# Altium project VESC_DEVICE_75100.PrjPcb
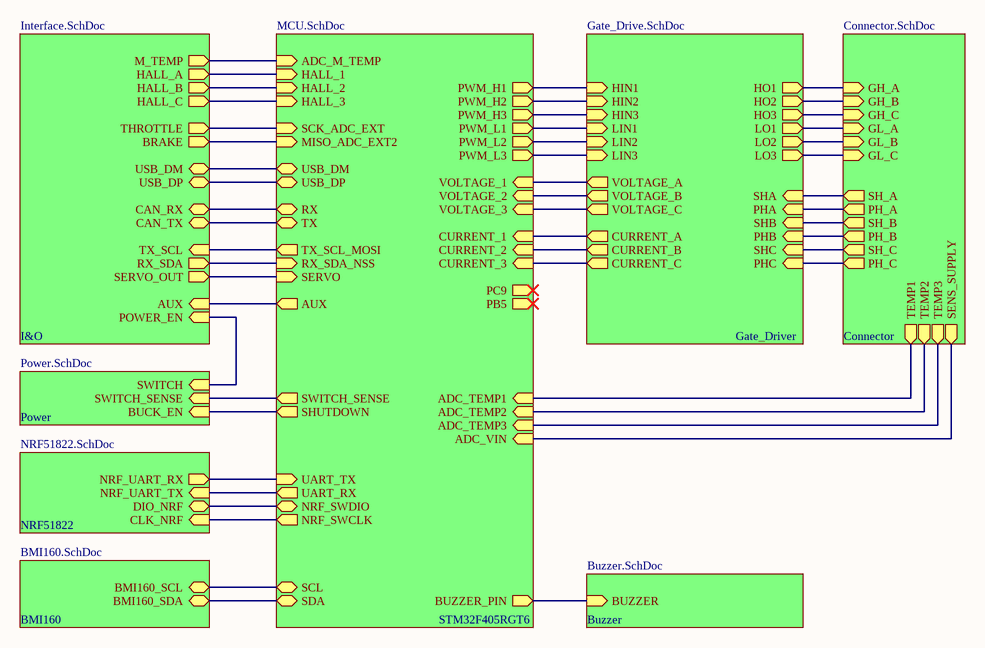
[diagram p0: VESC_75100.SchDoc]
9 sheets, 217 parts. Net scope: hierarchical (ports join the sheet entries above them; power ports are global).
Board file: VESC_DEVICE_75100.PcbDoc
Sheets:
  VESC_75100.SchDoc
    STM32F405RGT6 = MCU.SchDoc
    Gate_Driver = Gate_Drive.SchDoc
    I&O = Interface.SchDoc
    Power = Power.SchDoc
    NRF51822 = NRF51822.SchDoc
    BMI160 = BMI160.SchDoc
    Connector = Connector.SchDoc
    Buzzer = Buzzer.SchDoc

## Sheet VESC_75100.SchDoc
size A4

### Sub-sheets
BMI160 = BMI160.SchDoc: BMI160_SCL (bidir), BMI160_SDA (bidir)
Buzzer = Buzzer.SchDoc: BUZZER (in)
Connector = Connector.SchDoc: TEMP1 (out), TEMP2 (out), TEMP3 (out), SH_A (out), SH_B (out), SH_C (out), PH_B (out), PH_C (out), PH_A (out), GL_A (in), GL_B (in), GL_C (in), GH_A (in), GH_B (in), GH_C (in), SENS_SUPPLY (out)
Gate_Driver = Gate_Drive.SchDoc: HIN3 (in), LIN3 (in), LIN1 (in), LIN2 (in), HIN1 (in), HIN2 (in), HO1 (out), HO2 (out), HO3 (out), LO1 (out), LO2 (out), LO3 (out), CURRENT_A (out), CURRENT_B (out), CURRENT_C (out), VOLTAGE_C (out), VOLTAGE_B (out), VOLTAGE_A (out), SHA (in), PHA (in), SHB (in), PHB (in), SHC (in), PHC (in)
I&O = Interface.SchDoc: CAN_TX (bidir), CAN_RX (bidir), USB_DP (bidir), USB_DM (bidir), SERVO_OUT (out), RX_SDA (out), TX_SCL (in), HALL_A (out), HALL_B (out), HALL_C (out), M_TEMP (out), POWER_EN (in), BRAKE (out), THROTTLE (out), AUX (in)
NRF51822 = NRF51822.SchDoc: NRF_UART_RX (out), NRF_UART_TX (in), DIO_NRF (bidir), CLK_NRF (in)
Power = Power.SchDoc: BUCK_EN (in), SWITCH (in), SWITCH_SENSE (in)
STM32F405RGT6 = MCU.SchDoc: ADC_TEMP1 (in), RX_SDA_NSS (in), SCK_ADC_EXT (in), MISO_ADC_EXT2 (in), TX_SCL_MOSI (out), USB_DM (bidir), USB_DP (bidir), ADC_TEMP2 (in), ADC_TEMP3 (in), SERVO (in), RX (bidir), TX (bidir), ADC_VIN (in), ADC_M_TEMP (in), SHUTDOWN (out), HALL_1 (in), HALL_2 (in), HALL_3 (in), PC9 (out), UART_TX (in), UART_RX (out), SDA (bidir), SCL (bidir), PWM_L1 (out), PWM_H1 (out), PWM_L2 (out), PWM_L3 (out), PWM_H2 (out), PWM_H3 (out), VOLTAGE_1 (in), VOLTAGE_2 (in), VOLTAGE_3 (in), CURRENT_1 (in), CURRENT_2 (in), CURRENT_3 (in), NRF_SWDIO (bidir), NRF_SWCLK (out), SWITCH_SENSE (out), BUZZER_PIN (out), AUX (out), PB5 (out)

### Nets
ADC_TEMP1: sheet STM32F405RGT6/ADC_TEMP1, sheet Connector/TEMP1
ADC_TEMP2: sheet STM32F405RGT6/ADC_TEMP2, sheet Connector/TEMP2
ADC_TEMP3: sheet STM32F405RGT6/ADC_TEMP3, sheet Connector/TEMP3
ADC_VIN: sheet STM32F405RGT6/ADC_VIN, sheet Connector/SENS_SUPPLY
AUX: sheet STM32F405RGT6/AUX, sheet I&O/AUX
BMI160_SCL: sheet STM32F405RGT6/SCL, sheet BMI160/BMI160_SCL
BMI160_SDA: sheet STM32F405RGT6/SDA, sheet BMI160/BMI160_SDA
BRAKE: sheet STM32F405RGT6/MISO_ADC_EXT2, sheet I&O/BRAKE
BUCK_EN: sheet STM32F405RGT6/SHUTDOWN, sheet Power/BUCK_EN
BUZZER: sheet STM32F405RGT6/BUZZER_PIN, sheet Buzzer/BUZZER
CAN_RX: sheet STM32F405RGT6/RX, sheet I&O/CAN_RX
CAN_TX: sheet STM32F405RGT6/TX, sheet I&O/CAN_TX
CLK_NRF: sheet STM32F405RGT6/NRF_SWCLK, sheet NRF51822/CLK_NRF
CURRENT_1: sheet STM32F405RGT6/CURRENT_1, sheet Gate_Driver/CURRENT_A
CURRENT_2: sheet STM32F405RGT6/CURRENT_2, sheet Gate_Driver/CURRENT_B
CURRENT_3: sheet STM32F405RGT6/CURRENT_3, sheet Gate_Driver/CURRENT_C
DIO_NRF: sheet STM32F405RGT6/NRF_SWDIO, sheet NRF51822/DIO_NRF
GH_A: sheet Gate_Driver/HO1, sheet Connector/GH_A
GH_B: sheet Gate_Driver/HO2, sheet Connector/GH_B
GH_C: sheet Gate_Driver/HO3, sheet Connector/GH_C
GL_A: sheet Gate_Driver/LO1, sheet Connector/GL_A
GL_B: sheet Gate_Driver/LO2, sheet Connector/GL_B
GL_C: sheet Gate_Driver/LO3, sheet Connector/GL_C
HALL_1: sheet STM32F405RGT6/HALL_1, sheet I&O/HALL_A
HALL_2: sheet STM32F405RGT6/HALL_2, sheet I&O/HALL_B
HALL_3: sheet STM32F405RGT6/HALL_3, sheet I&O/HALL_C
HIN1: sheet STM32F405RGT6/PWM_H1, sheet Gate_Driver/HIN1
HIN2: sheet STM32F405RGT6/PWM_H2, sheet Gate_Driver/HIN2
HIN3: sheet STM32F405RGT6/PWM_H3, sheet Gate_Driver/HIN3
LIN1: sheet STM32F405RGT6/PWM_L1, sheet Gate_Driver/LIN1
LIN2: sheet STM32F405RGT6/PWM_L2, sheet Gate_Driver/LIN2
LIN3: sheet STM32F405RGT6/PWM_L3, sheet Gate_Driver/LIN3
M_TEMP: sheet STM32F405RGT6/ADC_M_TEMP, sheet I&O/M_TEMP
NRF_UART_RX: sheet STM32F405RGT6/UART_TX, sheet NRF51822/NRF_UART_RX
NRF_UART_TX: sheet STM32F405RGT6/UART_RX, sheet NRF51822/NRF_UART_TX
PHA: sheet Gate_Driver/PHA, sheet Connector/PH_A
PHB: sheet Gate_Driver/PHB, sheet Connector/PH_B
PHC: sheet Gate_Driver/PHC, sheet Connector/PH_C
POWER_EN: sheet I&O/POWER_EN, sheet Power/SWITCH
RX_SDA_NSS: sheet STM32F405RGT6/RX_SDA_NSS, sheet I&O/RX_SDA
SCK_ADC_EXT: sheet STM32F405RGT6/SCK_ADC_EXT, sheet I&O/THROTTLE
SERVO: sheet STM32F405RGT6/SERVO, sheet I&O/SERVO_OUT
SHA: sheet Gate_Driver/SHA, sheet Connector/SH_A
SHB: sheet Gate_Driver/SHB, sheet Connector/SH_B
SHC: sheet Gate_Driver/SHC, sheet Connector/SH_C
SWITCH_SENSE: sheet STM32F405RGT6/SWITCH_SENSE, sheet Power/SWITCH_SENSE
TX_SCL_MOSI: sheet STM32F405RGT6/TX_SCL_MOSI, sheet I&O/TX_SCL
USB_DM: sheet STM32F405RGT6/USB_DM, sheet I&O/USB_DM
USB_DP: sheet STM32F405RGT6/USB_DP, sheet I&O/USB_DP
VOLTAGE_A: sheet STM32F405RGT6/VOLTAGE_1, sheet Gate_Driver/VOLTAGE_A
VOLTAGE_B: sheet STM32F405RGT6/VOLTAGE_2, sheet Gate_Driver/VOLTAGE_B
VOLTAGE_C: sheet STM32F405RGT6/VOLTAGE_3, sheet Gate_Driver/VOLTAGE_C

## Sheet MCU.SchDoc: STM32F405RGT6
size A4; SheetNumber: 1; SheetTotal: 7
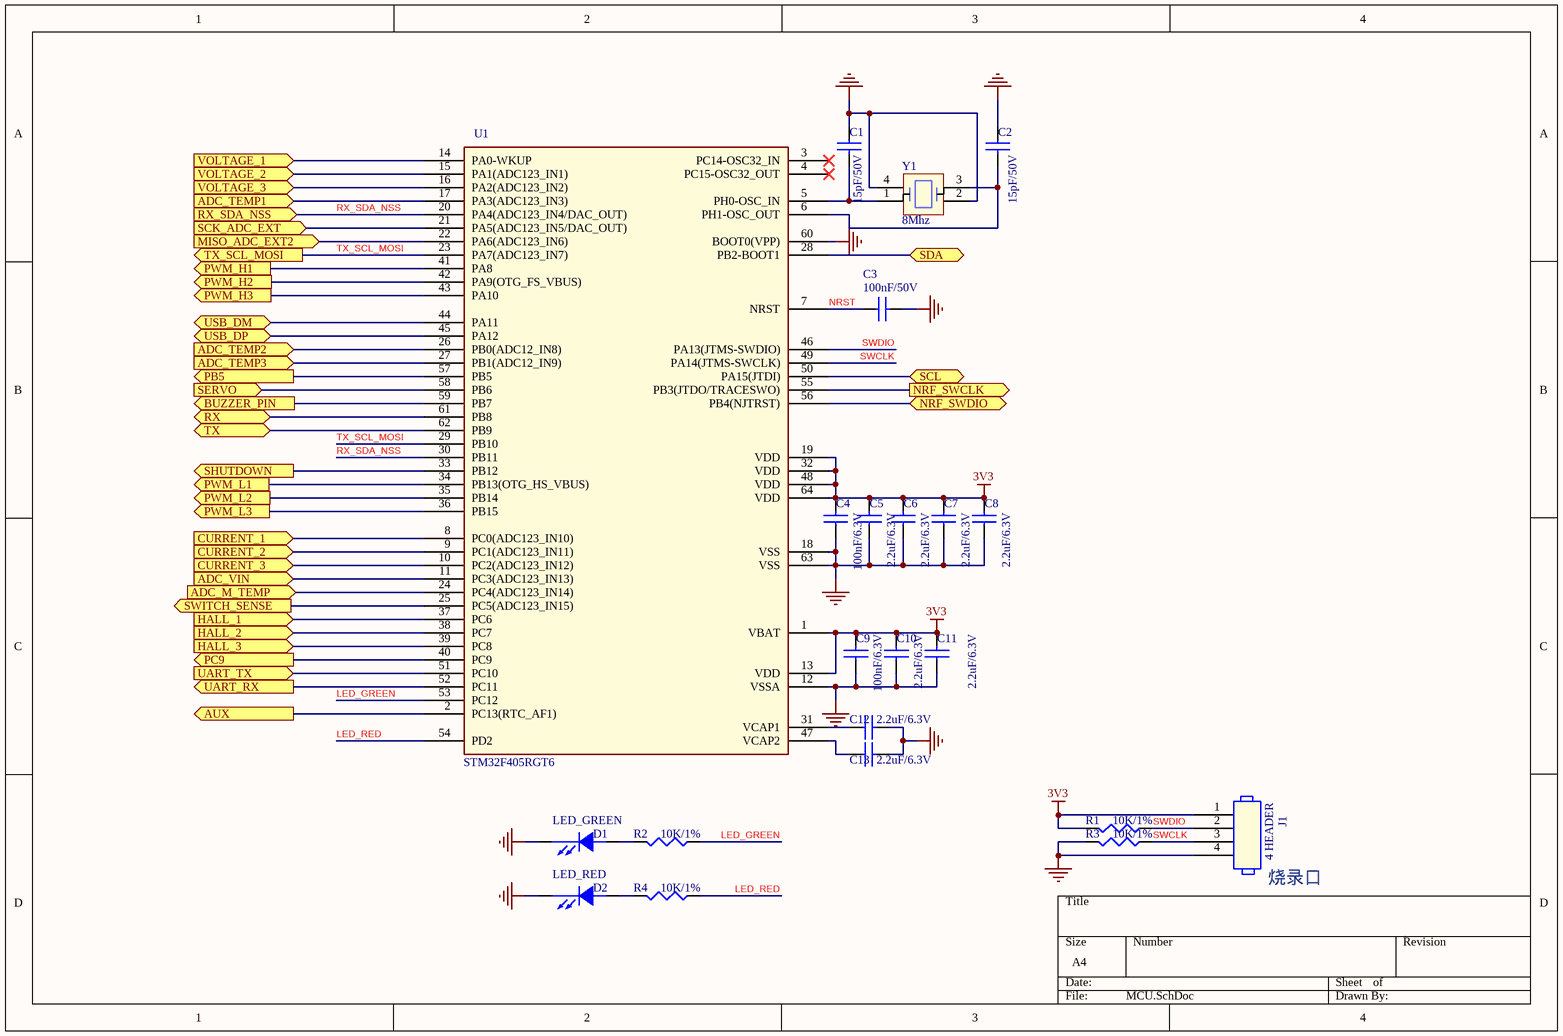
[diagram p1: MCU.SchDoc]

### Parts
C1  15pF/50V  [C0402]
C2  15pF/50V  [C0402]
C3  100nF/50V  [C0402]
C4  100nF/6.3V  [C0402]
C5  2.2uF/6.3V  [C0402]
C6  2.2uF/6.3V  [C0402]
C7  2.2uF/6.3V  [C0402]
C8  2.2uF/6.3V  [C0402]
C9  100nF/6.3V  [C0402]
C10  2.2uF/6.3V  [C0402]
C11  2.2uF/6.3V  [C0402]
C12  2.2uF/6.3V  [C0402]
C13  2.2uF/6.3V  [C0402]
D1  LED_GREEN  [LED0603]
D2  LED_RED  [LED0603]
J1  4 HEADER  [ISP-4P-2_54]
R1  10K/1%  [R0402]
R2  10K/1%  [R0402]
R3  10K/1%  [R0402]
R4  10K/1%  [R0402]
U1  STM32F405RGT6  [LQFP64_10X10_05P]
Y1  8Mhz  [CRYSTAL-SMD_4P-L3.2-W2.5-BL]

### Ports
ADC_M_TEMP (in, see VESC_75100[2A]), ADC_TEMP1 (in, see VESC_75100[3C]), ADC_TEMP2 (in, see VESC_75100[3C]), ADC_TEMP3 (in, see VESC_75100[3C]), ADC_VIN (in, see VESC_75100[3C]), AUX (out, see VESC_75100[2B], Interface[3B]), BUZZER_PIN (out, see VESC_75100[3C]), CURRENT_1 (in, see VESC_75100[3B]), CURRENT_2 (in, see VESC_75100[3B]), CURRENT_3 (in, see VESC_75100[3B]), HALL_1 (in, see VESC_75100[2A]), HALL_2 (in, see VESC_75100[2A]), HALL_3 (in, see VESC_75100[2B]), MISO_ADC_EXT2 (in, see VESC_75100[2B]), NRF_SWCLK (out, see VESC_75100[2C]), NRF_SWDIO (bidir, see VESC_75100[2C]), PB5 (out, see VESC_75100[3B]), PC9 (out, see VESC_75100[3B]), PWM_H1 (out, see VESC_75100[3A]), PWM_H2 (out, see VESC_75100[3B]), PWM_H3 (out, see VESC_75100[3B]), PWM_L1 (out, see VESC_75100[3B]), PWM_L2 (out, see VESC_75100[3B]), PWM_L3 (out, see VESC_75100[3B]), RX (bidir, see VESC_75100[2B]), RX_SDA_NSS (in, see VESC_75100[2B]), SCK_ADC_EXT (in, see VESC_75100[2B]), SCL (bidir, see VESC_75100[2C]), SDA (bidir, see VESC_75100[2C]), SERVO (in, see VESC_75100[2B]), SHUTDOWN (out, see VESC_75100[2C]), SWITCH_SENSE (out, see VESC_75100[2C], Power[1B]), TX (bidir, see VESC_75100[2B]), TX_SCL_MOSI (out, see VESC_75100[2B]), UART_RX (out, see VESC_75100[2C]), UART_TX (in, see VESC_75100[2C]), USB_DM (bidir, see VESC_75100[2B], Interface[2C]), USB_DP (bidir, see VESC_75100[2B], Interface[2C]), VOLTAGE_1 (in, see VESC_75100[3B]), VOLTAGE_2 (in, see VESC_75100[3B]), VOLTAGE_3 (in, see VESC_75100[3B])

### Nets
3V3: C4.2 C5.2 C6.2 C7.2 C8.2 C9.2 C10.2 C11.2 J1.1 R1.2 U1.1(VBAT) U1.13(VDD) U1.19(VDD) U1.32(VDD) U1.48(VDD) U1.64(VDD)
GND: C1.1 C2.1 C3.2 C4.1 C5.1 C6.1 C7.1 C8.1 C9.1 C10.1 C11.1 C12.2 C13.2 D1.1(CATHODE) D2.1(CATHODE) J1.4 R3.2 U1.12(VSSA) U1.18(VSS) U1.60(BOOT0(VPP)) U1.63(VSS) Y1.2(GND_1) Y1.4(GND_2)
ADC_TEMP1: U1.17(PA3(ADC123_IN3)) ; port ADC_TEMP1
ADC_TEMP2: U1.26(PB0(ADC12_IN8)) ; port ADC_TEMP2
ADC_TEMP3: U1.27(PB1(ADC12_IN9)) ; port ADC_TEMP3
ADC_VIN: U1.11(PC3(ADC123_IN13)) ; port ADC_VIN
AUX: U1.2(PC13(RTC_AF1)) ; port AUX
BMI160_SCL: U1.50(PA15(JTDI)) ; port SCL
BMI160_SDA: U1.28(PB2-BOOT1) ; port SDA
BRAKE: U1.22(PA6(ADC123_IN6)) ; port MISO_ADC_EXT2
BUCK_EN: U1.33(PB12) ; port SHUTDOWN
BUZZER: U1.59(PB7) ; port BUZZER_PIN
CAN_RX: U1.61(PB8) ; port RX
CAN_TX: U1.62(PB9) ; port TX
CLK_NRF: U1.55(PB3(JTDO/TRACESWO)) ; port NRF_SWCLK
CURRENT_1: U1.8(PC0(ADC123_IN10)) ; port CURRENT_1
CURRENT_2: U1.9(PC1(ADC123_IN11)) ; port CURRENT_2
CURRENT_3: U1.10(PC2(ADC123_IN12)) ; port CURRENT_3
DIO_NRF: U1.56(PB4(NJTRST)) ; port NRF_SWDIO
HALL_1: U1.37(PC6) ; port HALL_1
HALL_2: U1.38(PC7) ; port HALL_2
HALL_3: U1.39(PC8) ; port HALL_3
HIN1: U1.41(PA8) ; port PWM_H1
HIN2: U1.42(PA9(OTG_FS_VBUS)) ; port PWM_H2
HIN3: U1.43(PA10) ; port PWM_H3
LED_GREEN: R2.1 U1.53(PC12)
LED_RED: R4.1 U1.54(PD2)
LIN1: U1.34(PB13(OTG_HS_VBUS)) ; port PWM_L1
LIN2: U1.35(PB14) ; port PWM_L2
LIN3: U1.36(PB15) ; port PWM_L3
M_TEMP: U1.24(PC4(ADC123_IN14)) ; port ADC_M_TEMP
NRF_UART_RX: U1.51(PC10) ; port UART_TX
NRF_UART_TX: U1.52(PC11) ; port UART_RX
NRST: C3.1 U1.7(NRST)
PB5: U1.57(PB5) ; port PB5
PC9: U1.40(PC9) ; port PC9
RX_SDA_NSS: U1.20(PA4(ADC123_IN4/DAC_OUT)) U1.30(PB11) ; port RX_SDA_NSS
SCK_ADC_EXT: U1.21(PA5(ADC123_IN5/DAC_OUT)) ; port SCK_ADC_EXT
SERVO: U1.58(PB6) ; port SERVO
SWCLK: J1.3 R3.1 U1.49(PA14(JTMS-SWCLK))
SWDIO: J1.2 R1.1 U1.46(PA13(JTMS-SWDIO))
SWITCH_SENSE: U1.25(PC5(ADC123_IN15)) ; port SWITCH_SENSE
TX_SCL_MOSI: U1.23(PA7(ADC123_IN7)) U1.29(PB10) ; port TX_SCL_MOSI
USB_DM: U1.44(PA11) ; port USB_DM
USB_DP: U1.45(PA12) ; port USB_DP
VOLTAGE_A: U1.14(PA0-WKUP) ; port VOLTAGE_1
VOLTAGE_B: U1.15(PA1(ADC123_IN1)) ; port VOLTAGE_2
VOLTAGE_C: U1.16(PA2(ADC123_IN2)) ; port VOLTAGE_3
NetC1_2: C1.2 U1.5(PH0-OSC_IN) Y1.1(CRYSTAL_1)
NetC2_2: C2.2 U1.6(PH1-OSC_OUT) Y1.3(CRYSTAL_2)
NetC12_1: C12.1 U1.31(VCAP1)
NetC13_1: C13.1 U1.47(VCAP2)
NetD1_2: D1.2(ANODE) R2.2
NetD2_2: D2.2(ANODE) R4.2

Not connected (* = marked no-connect by the designer): U1 3(PC14-OSC32_IN)* 4(PC15-OSC32_OUT)*

### Notes on the sheet
- (near J1) 烧录口

### Library data of the parts
C1-C13 = CAP NP: PCB Footprint: C0402
D1 D2 = LED: PCB Footprint: LED0603
R1-R4 = RESISTOR: PCB Footprint: R0402
Y1 = 8Mhz: Crystal or Oscillator; Manufacturer_Name: Seiko Epson Corporation; Manufacturer_Part_Number: Q22FA12800400; Datasheet Link: https://datasheet.lcsc.com/szlcsc/Seiko-Epson-Q22FA12800400_C255875.pdf; Height: 0.5mm
J1 = 4 HEADER: PCB Footprint: ISP-4P-2_54

## Sheet Gate_Drive.SchDoc
size A4
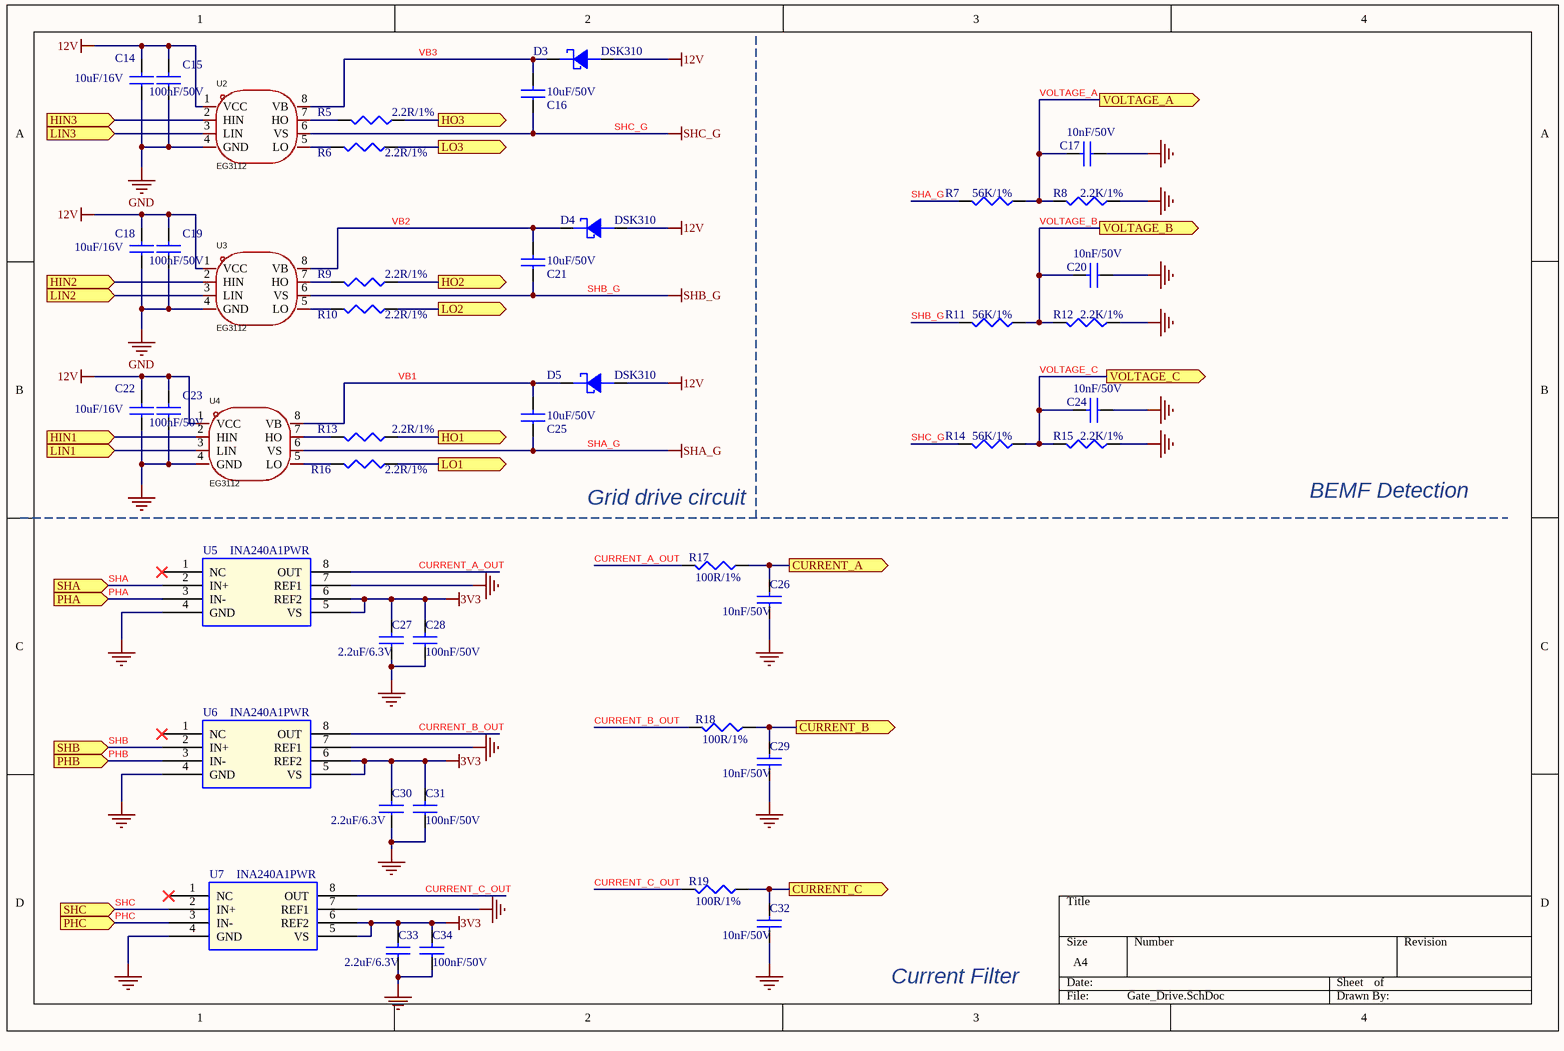
[diagram p2: Gate_Drive.SchDoc]

### Parts
C14  10uF/16V  [C0603]
C15  100nF/50V  [C0603]
C16  10uF/50V  [C0603]
C17  10nF/50V  [C0402]
C18  10uF/16V  [C0603]
C19  100nF/50V  [C0603]
C20  10nF/50V  [C0402]
C21  10uF/50V  [C0603]
C22  10uF/16V  [C0603]
C23  100nF/50V  [C0603]
C24  10nF/50V  [C0402]
C25  10uF/50V  [C0603]
C26  10nF/50V  [C0402]
C27  2.2uF/6.3V  [C0402]
C28  100nF/50V  [C0402]
C29  10nF/50V  [C0402]
C30  2.2uF/6.3V  [C0402]
C31  100nF/50V  [C0402]
C32  10nF/50V  [C0402]
C33  2.2uF/6.3V  [C0402]
C34  100nF/50V  [C0402]
D3  DSK310  [SOD-123F]
D4  DSK310  [SOD-123F]
D5  DSK310  [SOD-123F]
R5  2.2R/1%  [R0603]
R6  2.2R/1%  [R0603]
R7  56K/1%  [R0402]
R8  2.2K/1%  [R0402]
R9  2.2R/1%  [R0603]
R10  2.2R/1%  [R0603]
R11  56K/1%  [R0402]
R12  2.2K/1%  [R0402]
R13  2.2R/1%  [R0603]
R14  56K/1%  [R0402]
R15  2.2K/1%  [R0402]
R16  2.2R/1%  [R0603]
R17  100R/1%  [R0402]
R18  100R/1%  [R0402]
R19  100R/1%  [R0402]
U2  EG3112  [SOIC-8_L4.9-W3.9-P1.27-LS6.0-BL]
U3  EG3112  [SOIC-8_L4.9-W3.9-P1.27-LS6.0-BL]
U4  EG3112  [SOIC-8_L4.9-W3.9-P1.27-LS6.0-BL]
U5  INA240A1PWR  [TSSOP-8]
U6  INA240A1PWR  [TSSOP-8]
U7  INA240A1PWR  [TSSOP-8]

### Ports
CURRENT_A (out, see VESC_75100[3B]), CURRENT_B (out, see VESC_75100[3B]), CURRENT_C (out, see VESC_75100[3B]), HIN1 (in, see VESC_75100[3A]), HIN2 (in, see VESC_75100[3B]), HIN3 (in, see VESC_75100[3B]), HO1 (out, see VESC_75100[3A]), HO2 (out, see VESC_75100[3B]), HO3 (out, see VESC_75100[3B]), LIN1 (in, see VESC_75100[3B]), LIN2 (in, see VESC_75100[3B]), LIN3 (in, see VESC_75100[3B]), LO1 (out, see VESC_75100[3B]), LO2 (out, see VESC_75100[3B]), LO3 (out, see VESC_75100[3B]), PHA (in, see VESC_75100[3B]), PHB (in, see VESC_75100[3B]), PHC (in, see VESC_75100[3B]), SHA (in, see VESC_75100[3B]), SHB (in, see VESC_75100[3B]), SHC (in, see VESC_75100[3B]), VOLTAGE_A (out, see VESC_75100[3B]), VOLTAGE_B (out, see VESC_75100[3B]), VOLTAGE_C (out, see VESC_75100[3B])

### Nets
3V3: C27.2 C28.2 C30.2 C31.2 C33.2 C34.2 U5.5(VS) U5.6(REF2) U6.5(VS) U6.6(REF2) U7.5(VS) U7.6(REF2)
12V: C14.2 C15.2 C18.2 C19.2 C22.2 C23.2 D3.2(A) D4.2(A) D5.2(A) U2.1(VCC) U3.1(VCC) U4.1(VCC)
GND: C14.1 C15.1 C17.1 C18.1 C19.1 C20.1 C22.1 C23.1 C24.1 C26.1 C27.1 C28.1 C29.1 C30.1 C31.1 C32.1 C33.1 C34.1 R8.1 R12.1 R15.1 U2.4(GND) U3.4(GND) U4.4(GND) U5.4(GND) U5.7(REF1) U6.4(GND) U6.7(REF1) U7.4(GND) U7.7(REF1)
SHA_G: C25.1 R7.2 U4.6(VS)
SHB_G: C21.1 R11.2 U3.6(VS)
SHC_G: C16.1 R14.2 U2.6(VS)
CURRENT_1: C26.2 R17.1 ; port CURRENT_A
CURRENT_2: C29.2 R18.1 ; port CURRENT_B
CURRENT_3: C32.2 R19.1 ; port CURRENT_C
CURRENT_A_OUT: R17.2 U5.8(OUT)
CURRENT_B_OUT: R18.2 U6.8(OUT)
CURRENT_C_OUT: R19.2 U7.8(OUT)
GH_A: R13.1 ; port HO1
GH_B: R9.1 ; port HO2
GH_C: R5.1 ; port HO3
GL_A: R16.1 ; port LO1
GL_B: R10.1 ; port LO2
GL_C: R6.1 ; port LO3
HIN1: U4.2(HIN) ; port HIN1
HIN2: U3.2(HIN) ; port HIN2
HIN3: U2.2(HIN) ; port HIN3
LIN1: U4.3(LIN) ; port LIN1
LIN2: U3.3(LIN) ; port LIN2
LIN3: U2.3(LIN) ; port LIN3
PHA: U5.3(IN-) ; port PHA
PHB: U6.3(IN-) ; port PHB
PHC: U7.3(IN-) ; port PHC
SHA: U5.2(IN+) ; port SHA
SHB: U6.2(IN+) ; port SHB
SHC: U7.2(IN+) ; port SHC
VB1: C25.2 D5.1(K) U4.8(VB)
VB2: C21.2 D4.1(K) U3.8(VB)
VB3: C16.2 D3.1(K) U2.8(VB)
VOLTAGE_A: C17.2 R7.1 R8.2 ; port VOLTAGE_A
VOLTAGE_B: C20.2 R11.1 R12.2 ; port VOLTAGE_B
VOLTAGE_C: C24.2 R14.1 R15.2 ; port VOLTAGE_C
NetR5_2: R5.2 U2.7(HO)
NetR6_2: R6.2 U2.5(LO)
NetR9_2: R9.2 U3.7(HO)
NetR10_2: R10.2 U3.5(LO)
NetR13_2: R13.2 U4.7(HO)
NetR16_2: R16.2 U4.5(LO)

Not connected (* = marked no-connect by the designer): U5 1(NC)*; U6 1(NC)*; U7 1(NC)*

### Notes on the sheet
- Grid drive circuit
- BEMF Detection
- Current Filter

### Library data of the parts
C14-C34 = CAP NP
  C14-C16 C18 C19 C21-C23 C25: PCB Footprint: C0603
  C17 C20 C24 C26-C34: PCB Footprint: C0402
D3-D5 = DIODE SCHOTTKY21: PCB Footprint: SOD-123F
R5 R6 R9 R10 R13 R16 = RESISTOR: PCB Footprint: R0402
R7 R8 R11 R12 R14 R15 R17-R19 = RESISTOR: PCB Footprint: R0402
U2-U4 = EG3112: Manufacturer: EG(屹晶微); Add into BOM: yes; Symbol: EG3112; Device: EG3112; LCSC Part Name: EG3112; Supplier Part: C111908; Manufacturer Part: EG3112; Supplier Footprint: SOIC-8; JLCPCB Part Class: Extended Part; Datasheet: https://atta.szlcsc.com/upload/public/pdf/source/20230725/3992D5BD05E91E0CBB5D3EE72F4B3B26.pdf; Supplier: LCSC; Convert to PCB: yes
U5-U7 = INA240A1PWR: PCB Footprint: TSSOP-8

## Sheet Interface.SchDoc
size A4
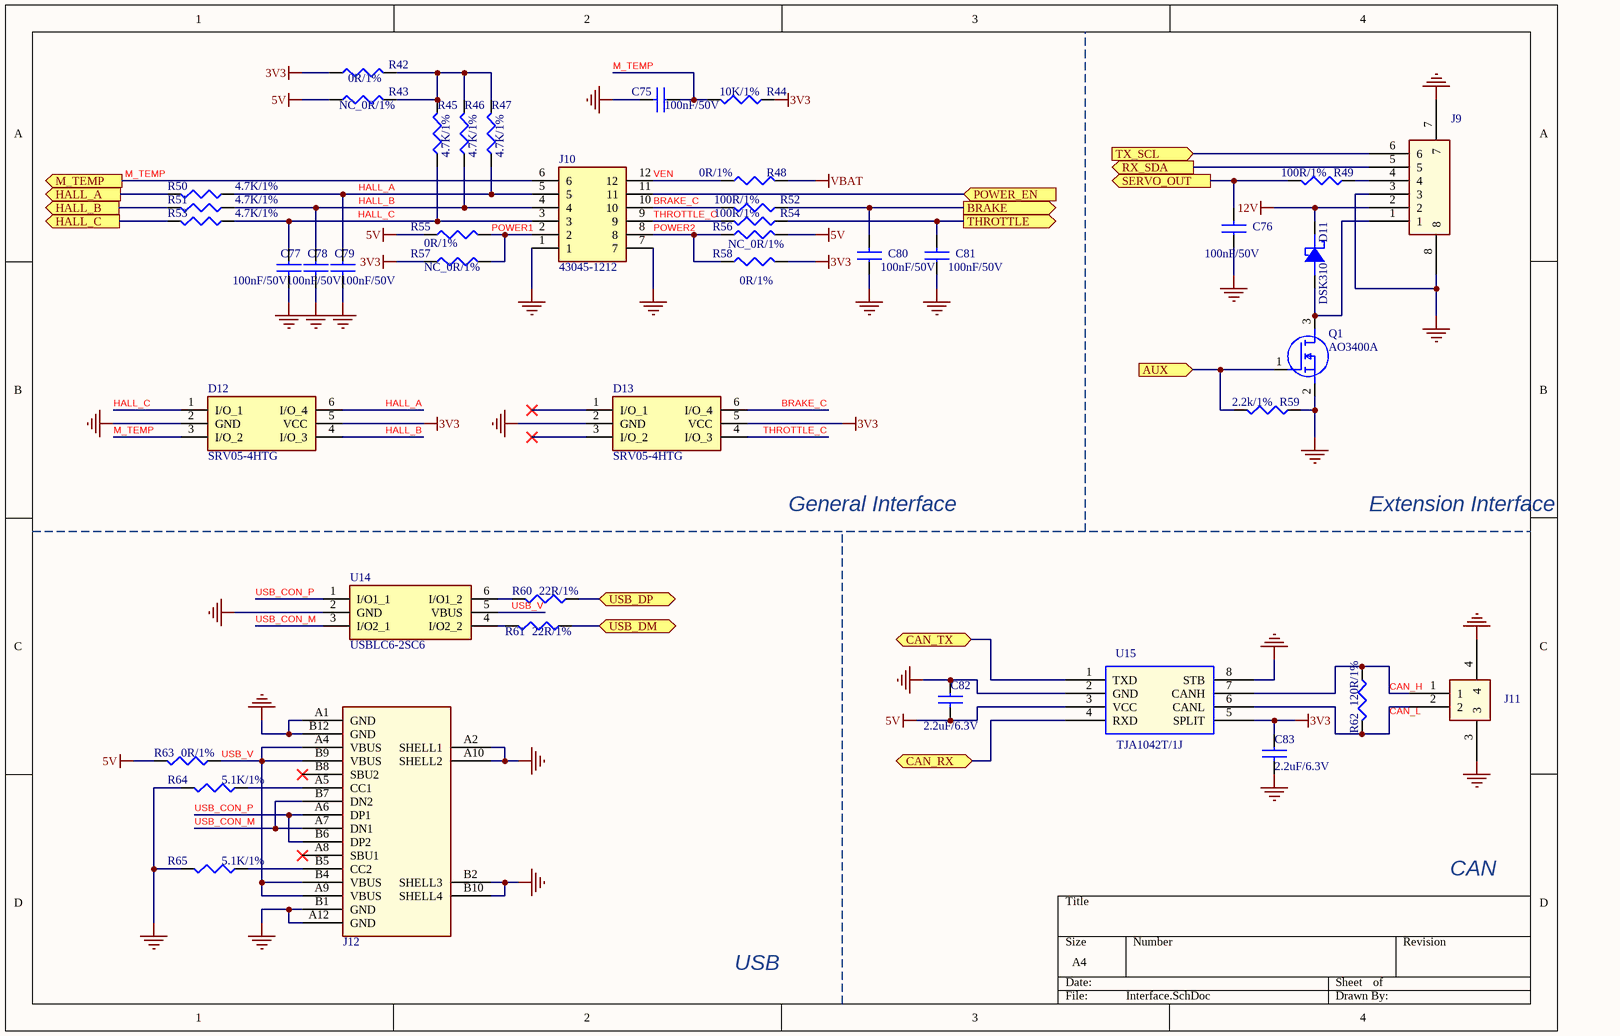
[diagram p3: Interface.SchDoc]

### Parts
C75  100nF/50V  [C0402]
C76  100nF/50V  [C0402]
C77  100nF/50V  [C0402]
C78  100nF/50V  [C0402]
C79  100nF/50V  [C0402]
C80  100nF/50V  [C0402]
C81  100nF/50V  [C0402]
C82  2.2uF/6.3V  [C0402]
C83  2.2uF/6.3V  [C0402]
D11  DSK310  [SOD-123F]
D12  SRV05-4HTG  [SOT95P280X145-6N]
D13  SRV05-4HTG  [SOT95P280X145-6N]
J9  1.25-6PWTDK  [BM06BGHSTBTLFSN]  (value not drawn)
J10  43045-1212  [43045-12YY_121314]
J11  1.25-2PWTDK  [BM02B-GHS-TBT_1]  (value not drawn)
J12  TYPE-C 16PLC-H10.0  [USB-C-SMD_SOUHAN_TYPE-C-16PLT-H6.5]  (value not drawn)
Q1  AO3400A  [SOT95P280X125-3N]
R42  0R/1%  [Solder Bridge_0402]
R43  NC_0R/1%  [Solder Bridge_0402]
R44  10K/1%  [R0402]
R45  4.7K/1%  [R0402]
R46  4.7K/1%  [R0402]
R47  4.7K/1%  [R0402]
R48  0R/1%  [R0402]
R49  100R/1%  [R0402]
R50  4.7K/1%  [R0402]
R51  4.7K/1%  [R0402]
R52  100R/1%  [R0402]
R53  4.7K/1%  [R0402]
R54  100R/1%  [R0402]
R55  0R/1%  [Solder Bridge_0402]
R56  NC_0R/1%  [Solder Bridge_0402]
R57  NC_0R/1%  [Solder Bridge_0402]
R58  0R/1%  [Solder Bridge_0402]
R59  2.2k/1%  [R0402]
R60  22R/1%  [R0402]
R61  22R/1%  [R0402]
R62  120R/1%  [R0402]
R63  0R/1%  [R0603]
R64  5.1K/1%  [R0402]
R65  5.1K/1%  [R0402]
U14  USBLC6-2SC6  [SOT95P280X145-6N]
U15  TJA1042T/1J  [SOP-8]

### Ports
AUX (in, see VESC_75100[2B], MCU[1C]), BRAKE (out, see VESC_75100[2B]), CAN_RX (bidir, see VESC_75100[2B]), CAN_TX (bidir, see VESC_75100[2B]), HALL_A (out, see VESC_75100[2A]), HALL_B (out, see VESC_75100[2A]), HALL_C (out, see VESC_75100[2B]), M_TEMP (out, see VESC_75100[2A]), POWER_EN (in, see VESC_75100[2B]), RX_SDA (out, see VESC_75100[2B]), SERVO_OUT (out, see VESC_75100[2B]), THROTTLE (out, see VESC_75100[2B]), TX_SCL (in, see VESC_75100[2B]), USB_DM (bidir, see VESC_75100[2B], MCU[1B]), USB_DP (bidir, see VESC_75100[2B], MCU[1B])

### Nets
3V3: C83.1 D12.5(VCC) D13.5(VCC) R42.2 R44.2 R57.1 R58.1 U15.5(SPLIT)
5V: C82.2 R43.2 R55.1 R56.1 R63.2 U15.3(VCC)
12V: D11.1(K) J9.2
GND: C75.2 C76.1 C77.2 C78.2 C79.2 C80.1 C81.1 C82.1 C83.2 D12.2(GND) D13.2(GND) J9.3 J9.7 J9.8 J10.1 J10.7 J11.3 J11.4 J12.A1(GND) J12.A2(SHELL1) J12.A10(SHELL2) J12.A12(GND) J12.B1(GND) J12.B2(SHELL3) J12.B10(SHELL4) J12.B12(GND) Q1.2(S) R59.2 R64.2 R65.2 U14.2(GND) U15.2(GND) U15.8(STB)
VBAT: R48.1
AUX: Q1.1(G) R59.1 ; port AUX
BRAKE: C80.2 R52.2 ; port BRAKE
BRAKE_C: D13.6(I/O_4) J10.10 R52.1
CAN_H: J11.1 R62.1 U15.7(CANH)
CAN_L: J11.2 R62.2 U15.6(CANL)
CAN_RX: U15.4(RXD) ; port CAN_RX
CAN_TX: U15.1(TXD) ; port CAN_TX
HALL_1: R50.2 ; port HALL_A
HALL_2: R51.2 ; port HALL_B
HALL_3: R53.2 ; port HALL_C
HALL_A: C79.1 D12.6(I/O_4) J10.5 R47.1 R50.1
HALL_B: C78.1 D12.4(I/O_3) J10.4 R46.1 R51.1
HALL_C: C77.1 D12.1(I/O_1) J10.3 R45.1 R53.1
M_TEMP: C75.1 D12.3(I/O_2) J10.6 R44.1 ; port M_TEMP
POWER1: J10.2 R55.2 R57.2
POWER2: J10.8 R56.2 R58.2
POWER_EN: J10.11 ; port POWER_EN
RX_SDA_NSS: J9.5 ; port RX_SDA
SCK_ADC_EXT: C81.2 R54.2 ; port THROTTLE
SERVO: C76.2 R49.1 ; port SERVO_OUT
THROTTLE_C: D13.4(I/O_3) J10.9 R54.1
TX_SCL_MOSI: J9.6 ; port TX_SCL
USB_CON_M: J12.A7(DN1) J12.B7(DN2) U14.3(I/O2_1)
USB_CON_P: J12.A6(DP1) J12.B6(DP2) U14.1(I/O1_1)
USB_DM: R61.1 ; port USB_DM
USB_DP: R60.1 ; port USB_DP
USB_V: J12.A4(VBUS) J12.A9(VBUS) J12.B4(VBUS) J12.B9(VBUS) R63.1 U14.5(VBUS)
VEN: J10.12 R48.2
NetD11_2: D11.2(A) J9.1 Q1.3(D)
NetJ9_4: J9.4 R49.2
NetJ12_A5: J12.A5(CC1) R64.1
NetJ12_B5: J12.B5(CC2) R65.1
NetR42_1: R42.1 R43.1 R45.2 R46.2 R47.2
NetR60_2: R60.2 U14.6(I/O1_2)
NetR61_2: R61.2 U14.4(I/O2_2)

Not connected (* = marked no-connect by the designer): D13 1(I/O_1)* 3(I/O_2)*; J12 A8(SBU1)* B8(SBU2)*

### Notes on the sheet
- General Interface
- Extension Interface
- CAN
- USB

### Library data of the parts
C75-C83 = CAP NP: PCB Footprint: C0402
D11 = DIODE SCHOTTKY21: PCB Footprint: SOD-123F
D12 D13 = SRV05-4HTG: TVS Diode (Uni-directional); Manufacturer_Name: LITTELFUSE; Datasheet Link: https://componentsearchengine.com/Datasheets/2/SRV05-4HTG.pdf; Height: 1.45mm; Manufacturer_Part_Number: SRV05-4HTG; Mouser Part Number: 576-SRV05-4HTG; Mouser Price/Stock: https://www.mouser.co.uk/ProductDetail/Littelfuse/SRV05-4HTG?qs=TI15CVqcli3Liexbf3C%2FVA%3D%3D; Arrow Part Number: SRV05-4HTG; Arrow Price/Stock: https://www.arrow.com/en/products/srv05-4htg/littelfuse?region=nac
J10 = 43045-1212: Connector; Manufacturer_Name: Molex; Datasheet Link: https://www.molex.com/pdm_docs/sd/430450612_sd.pdf; Height: 9.91mm; Manufacturer_Part_Number: 43045-1212; Mouser Part Number: 538-43045-1212; Mouser Price/Stock: https://www.mouser.co.uk/ProductDetail/Molex/43045-1212?qs=359VwiUTsp27ERpkj8aHfQ%3D%3D
J12 = TYPE-C 16PLC-H6.5: 连接器类型:Type-C;标准:USB 3.1;公母:母;安装方式:直插;触点数量:16P;端口数量:1;额定电流 - 电源:5A;触头材质:-;触头镀层:-;工作温度范围:-40℃~+85℃;; Manufacturer: SHOU HAN(首韩); Add into BOM: yes; Gender: 母; Number of Contacts: 16P; Number of Ports: 1; Current Rating - Power (Max): 5A; Rated Voltage (Max): 20V; Connect-Disconnect Life: 1万次; Core Colour: 黑色; Symbol: TYPE-C 16PLC-H10.0; Device: TYPE-C 16PLC-H10.0; LCSC Part Name: Type-C 母 直插; Supplier Part: C3151747; Manufacturer Part: TYPE-C 16PLC-H10.0; Supplier Footprint: 插件; Datasheet: https://atta.szlcsc.com/upload/public/pdf/source/20240529/CC9428849977884A813B584EA396EFE9.pdf; Supplier: LCSC; Convert to PCB: yes; Connector Type: Type-C; Standard: USB 3.1; Mounting Style: 直插; Contact Material: -; Contact Plating: -; Operating Temperature Range: -40℃~+85℃
Q1 = AO3400A: MOSFET (N-Channel); Manufacturer_Name: Alpha & Omega Semiconductors; Datasheet Link: http://aosmd.com/res/data_sheets/AO3400A.pdf; Height: 1.25mm; Manufacturer_Part_Number: AO3400A; Arrow Part Number: AO3400A; Arrow Price/Stock: https://www.arrow.com/en/products/ao3400a/alpha-and-omega-semiconductor?utm_currency=USD&region=nac
R42 R43 R55-R58 = RESISTOR: PCB Footprint: R0402
R44-R54 R59-R65 = RESISTOR
  R44-R54 R59-R62 R64 R65: PCB Footprint: R0402
  R63: PCB Footprint: R0603
U14 = USBLC6-2SC6: Integrated Circuit; Manufacturer_Name: STMicroelectronics; Datasheet Link: http://www.st.com/st-web-ui/static/active/en/resource/technical/document/datasheet/CD00050750.pdf; Height: 1.45mm; Manufacturer_Part_Number: USBLC6-2SC6; Mouser Part Number: 511-USBLC6-2SC6; Mouser Price/Stock: https://www.mouser.co.uk/ProductDetail/STMicroelectronics/USBLC6-2SC6?qs=po45yt2pPpu%2FhNIlwQdTlg%3D%3D; Arrow Part Number: USBLC6-2SC6; Arrow Price/Stock: https://www.arrow.com/en/products/usblc6-2sc6/stmicroelectronics?utm_currency=USD&region=europe
U15 = TJA1042T/1J: PCB Footprint: SOP-8

## Sheet Power.SchDoc
size A4
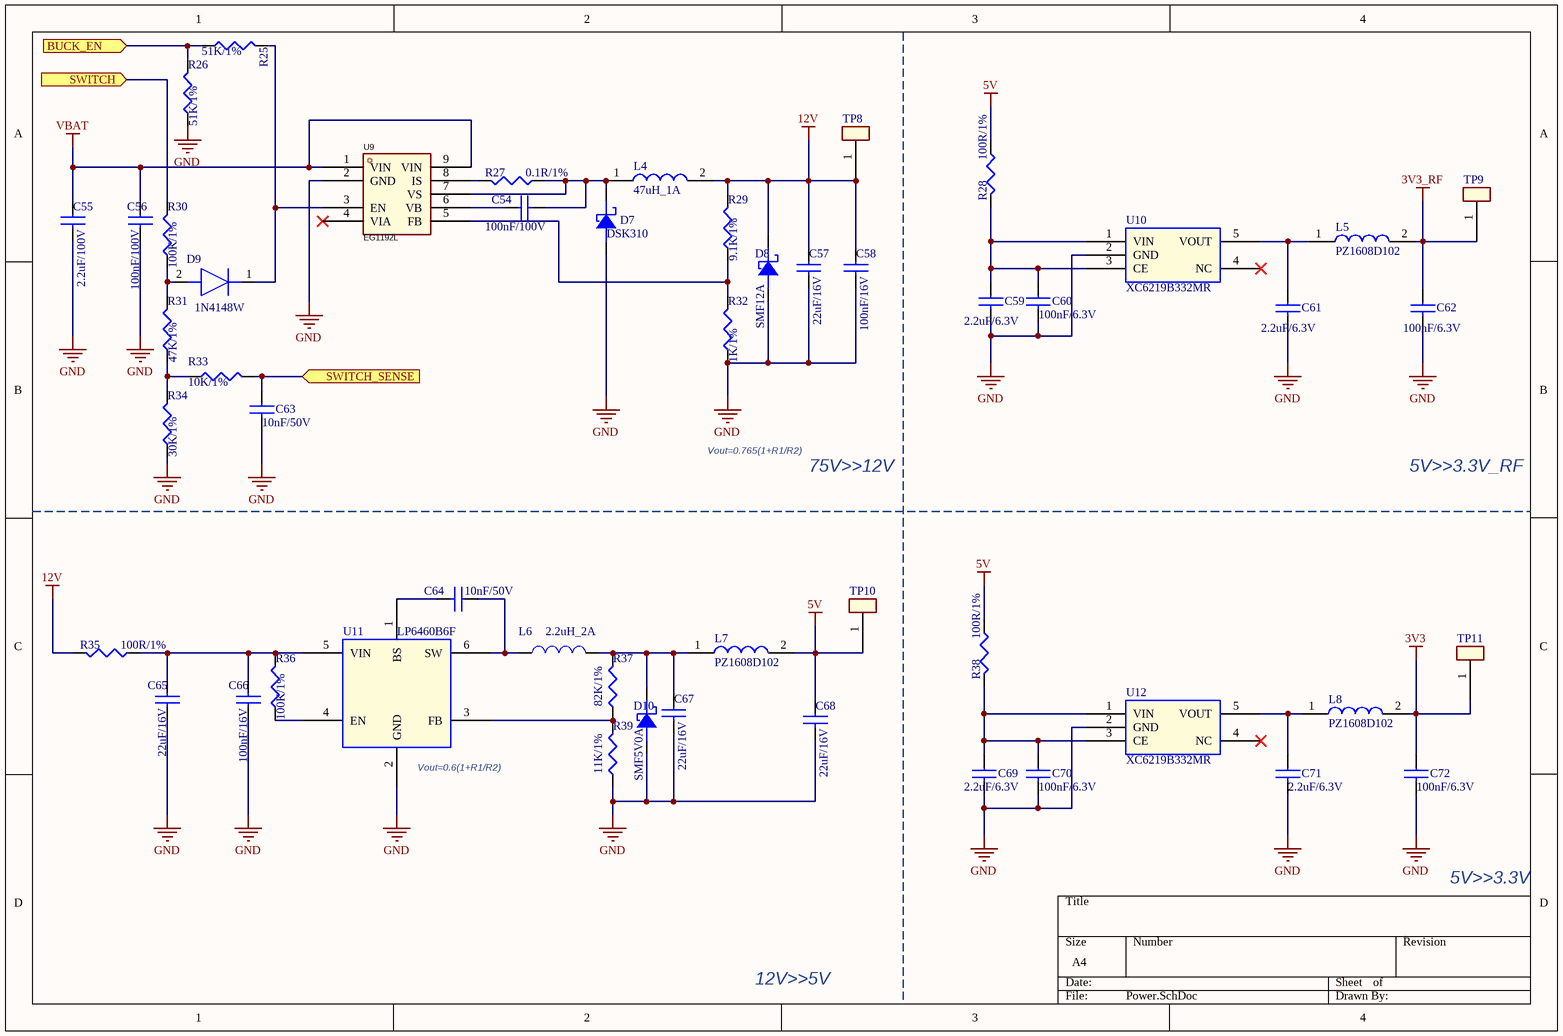
[diagram p4: Power.SchDoc]

### Parts
C54  100nF/100V  [C0603]
C55  2.2uF/100V  [C1206]
C56  100nF/100V  [C0603]
C57  22uF/16V  [C0805]
C58  100nF/16V  [C0805]
C59  2.2uF/6.3V  [C0402]
C60  100nF/6.3V  [C0402]
C61  2.2uF/6.3V  [C0402]
C62  100nF/6.3V  [C0402]
C63  10nF/50V  [C0402]
C64  10nF/50V  [C0402]
C65  22uF/16V  [C0805]
C66  100nF/16V  [C0805]
C67  22uF/16V  [C0805]
C68  22uF/16V  [C0805]
C69  2.2uF/6.3V  [C0402]
C70  100nF/6.3V  [C0402]
C71  2.2uF/6.3V  [C0402]
C72  100nF/6.3V  [C0402]
D7  DSK310  [SOD-123F]
D8  SMF12A  [SOD-123F]
D9  1N4148W  [1N4148WVGS08]
D10  SMF5V0A  [SOD-123F]
L4  47uH_1A  [L5040]
L5  PZ1608D102  [L0603]
L6  2.2uH_2A  [L4020]
L7  PZ1608D102  [L0603]
L8  PZ1608D102  [L0603]
R25  51K/1%  [R0402]
R26  51K/1%  [R0402]
R27  0.1R/1%  [R0603]
R28  100R/1%  [R0603]
R29  9.1K/1%  [R0402]
R30  100K/1%  [R0402]
R31  47K/1%  [R0402]
R32  1K/1%  [R0402]
R33  10K/1%  [R0402]
R34  30K/1%  [R0402]
R35  100R/1%  [R0603]
R36  100K/1%  [R0402]
R37  82K/1%  [R0402]
R38  100R/1%  [R0603]
R39  11K/1%  [R0402]
TP8  TEST POINT  [test_point_100_smd]  (value not drawn)
TP9  TEST POINT  [test_point_100_smd]  (value not drawn)
TP10  TEST POINT  [test_point_100_smd]  (value not drawn)
TP11  TEST POINT  [test_point_100_smd]  (value not drawn)
U9  EG1192L  [ESOP-8_L4.9-W3.9-P1.27-LS6.0-BL-EP-1]
U10  XC6219B332MR  [SOT-23-5]
U11  LP6460B6F  [SOT-23-6]
U12  XC6219B332MR  [SOT-23-5]

### Ports
BUCK_EN (in, see VESC_75100[2C]), SWITCH (in, see VESC_75100[2C]), SWITCH_SENSE (in, see VESC_75100[2C], MCU[1C])

### Nets
3V3: C72.1 L8.2 TP11.1
3V3_RF: C62.1 L5.2 TP9.1
5V: C68.1 L7.2 R28.1 R38.1 TP10.1
12V: C57.1 C58.1 D8.1(K) L4.2 R29.2 R35.2 TP8.1
GND: C55.2 C56.2 C57.2 C58.2 C59.2 C60.2 C61.2 C62.2 C63.2 C65.2 C66.2 C67.2 C68.2 C69.2 C70.2 C71.2 C72.2 D7.2(A) D8.2(A) D10.2(A) R26.1 R32.1 R34.1 R39.1 U9.2(GND) U10.2(GND) U11.2(GND) U12.2(GND)
VBAT: C55.1 C56.1 U9.1(VIN) U9.9(VIN)
BUCK_EN: R25.1 R26.2 ; port BUCK_EN
POWER_EN: R30.2 ; port SWITCH
SWITCH_SENSE: C63.1 R33.2 ; port SWITCH_SENSE
NetC54_1: C54.1 U9.6(VB)
NetC54_2: C54.2 D7.1(K) L4.1 R27.1 U9.7(VS)
NetC59_1: C59.1 C60.1 R28.2 U10.1(VIN) U10.3(CE)
NetC61_1: C61.1 L5.1 U10.5(VOUT)
NetC64_1: C64.1 L6.1 U11.6(SW)
NetC64_2: C64.2 U11.1(BS)
NetC65_1: C65.1 C66.1 R35.1 R36.2 U11.5(VIN)
NetC67_1: C67.1 D10.1(K) L6.2 L7.1 R37.2
NetC69_1: C69.1 C70.1 R38.2 U12.1(VIN) U12.3(CE)
NetC71_1: C71.1 L8.1 U12.5(VOUT)
NetD9_1: D9.1(K) R25.2 U9.3(EN)
NetD9_2: D9.2(A) R30.1 R31.2
NetR27_2: R27.2 U9.8(IS)
NetR29_1: R29.1 R32.2 U9.5(FB)
NetR31_1: R31.1 R33.1 R34.2
NetR36_1: R36.1 U11.4(EN)
NetR37_1: R37.1 R39.2 U11.3(FB)

Not connected (* = marked no-connect by the designer): U9 4(VIA)*; U10 4(NC)*; U12 4(NC)*

### Notes on the sheet
- Vout=0.765(1+R1/R2)
- 75V>>12V
- 5V>>3.3V_RF
- (near U11) Vout=0.6(1+R1/R2)
- 5V>>3.3V
- 12V>>5V

### Library data of the parts
C54-C72 = CAP NP
  C54 C56: PCB Footprint: C0603
  C55: PCB Footprint: C1206
  C57 C58 C65-C68: PCB Footprint: C0805
  C59-C64 C69-C72: PCB Footprint: C0402
D7 D8 D10 = DIODE SCHOTTKY21: PCB Footprint: SOD-123F
D9 = 1N4148W-V-GS08: Diode; Manufacturer_Name: Vishay; Datasheet Link: https://us.rs-online.com/m/d/a2789c8794cb0c42ced29f2dd8571f3c.pdf; Height: 1.35mm; Manufacturer_Part_Number: 1N4148W-V-GS08; Mouser Part Number: 625-1N4148W-V; Mouser Price/Stock: https://www.mouser.co.uk/ProductDetail/Vishay-Semiconductors/1N4148W-V-GS08?qs=TNTIDjy6APrS%2Fdgq1RSs3A%3D%3D; Arrow Part Number: 1N4148W-V-GS08; Arrow Price/Stock: https://www.arrow.com/en/products/1n4148w-v-gs08/vishay
L4 = 74404054221: Inductor; Manufacturer_Name: Wurth Elektronik; Datasheet Link: https://www.mouser.com/datasheet/2/445/74404054221-1280555.pdf; Height: 4mm; Manufacturer_Part_Number: 74404054221; Mouser Part Number: 710-74404054221; Mouser Price/Stock: https://www.mouser.co.uk/ProductDetail/Wurth-Elektronik/74404054221?qs=f9yNj16SXrLBSuRgk86STQ%3D%3D
L5 L7 L8 = PZ1608D102: Inductor; Manufacturer_Name: Murata Electronics; Manufacturer_Part_Number: LQG15HS4N7C02D; Datasheet Link: https://search.murata.co.jp/Ceramy/image/img/P02/JELF243B-0010.pdf; Height: 0.6mm; Mouser Part Number: 81-LQG15HS4N7C02D; Mouser Price/Stock: https://www.mouser.co.uk/ProductDetail/Murata-Electronics/LQG15HS4N7C02D?qs=60uY6ySkanQsgm4t8ngjFA%3D%3D; Arrow Part Number: LQG15HS4N7C02D; Arrow Price/Stock: https://www.arrow.com/en/products/lqg15hs4n7c02d/murata-manufacturing
L6 = INDUCTOR: PCB Footprint: L4020
R25 R26 R29-R34 R36 R37 R39 = RESISTOR: PCB Footprint: R0402
R27 R28 R35 R38 = RESISTOR: PCB Footprint: R0402
U9 = EG1192L: Manufacturer: EG(屹晶微); Manufacturer Part: EG1198; Symbol: EG1192; Add into BOM: yes; Function: 降压型; Input Voltage: 10V~120V; Output Current: 1.5A; Switching Frequency: 120kHz; Number of Outputs: 1; Topology: 降压式; Switch tube (built-in/external): 内置; Device: EG1192; LCSC Part Name: 高性价比宽电压降压DCDC电源芯片; Supplier Part: C2987436; Supplier Footprint: ESOP-8; JLCPCB Part Class: Extended Part; Datasheet: https://atta.szlcsc.com/upload/public/pdf/source/20211208/030CAF1F902F9A81F24E8BE238D4FEDC.pdf; Supplier: LCSC; Convert to PCB: yes; Output Type: -; Output Voltage: -; Operating Temperature: -45℃~+125℃; Synchronous Rectification: -; Quiescent Current (Iq): -
U10 U12 = XC6219B332MR: PCB Footprint: SOT-23-5
U11 = LP6460B6F: PCB Footprint: SOT-23-6

## Sheet NRF51822.SchDoc
size A4
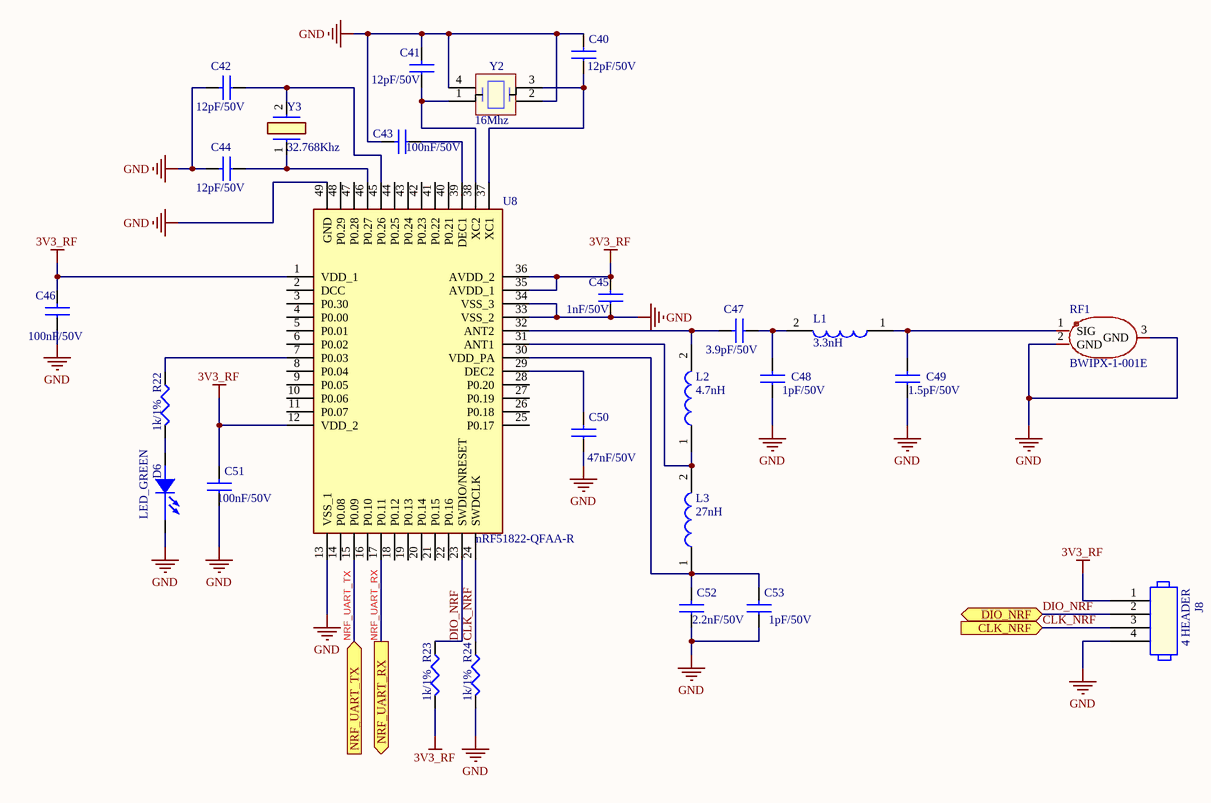
[diagram p5: NRF51822.SchDoc]

### Parts
C40  12pF/50V  [C0402]
C41  12pF/50V  [C0402]
C42  12pF/50V  [C0402]
C43  100nF/50V  [C0402]
C44  12pF/50V  [C0402]
C45  1nF/50V  [C0402]
C46  100nF/50V  [C0402]
C47  3.9pF/50V  [C0402]
C48  1pF/50V  [C0402]
C49  1.5pF/50V  [C0402]
C50  47nF/50V  [C0402]
C51  100nF/50V  [C0402]
C52  2.2nF/50V  [C0402]
C53  1pF/50V  [C0402]
D6  LED_GREEN  [LED0603]
J8  4 HEADER  [ISP-4P-2_54]
L1  3.3nH  [LQG15WH0N7B02D]
L2  4.7nH  [LQG15WH0N7B02D]
L3  27nH  [LQG15WH0N7B02D]
R22  1k/1%  [R0402]
R23  1k/1%  [R0402]
R24  1k/1%  [R0402]
RF1  BWIPX-1-001E  [IPEX-SMD_BWIPX-1-001E]
U8  nRF51822-QFAA-R  [QFN40P600X600X95-49N-D]
Y2  16Mhz  [Q22FA12800400]
Y3  32.768Khz  [ABS0532768KHZ9T]

### Ports
CLK_NRF (in, see VESC_75100[2C]), DIO_NRF (bidir, see VESC_75100[2C]), NRF_UART_RX (out, see VESC_75100[2C]), NRF_UART_TX (in, see VESC_75100[2C])

### Nets
3V3_RF: C45.2 C46.2 C51.2 J8.1 R23.1 U8.1(VDD_1) U8.12(VDD_2) U8.35(AVDD_1) U8.36(AVDD_2)
GND: C40.2 C41.2 C42.2 C43.2 C44.2 C45.1 C46.1 C48.1 C49.1 C50.1 C51.1 C52.1 C53.1 D6.1(CATHODE) J8.4 R24.1 RF1.2(GND) RF1.3(GND) U8.13(VSS_1) U8.33(VSS_2) U8.34(VSS_3) U8.49(GND) Y2.2(GND_1) Y2.4(GND_2)
CLK_NRF: J8.3 R24.2 U8.24(SWDCLK) ; port CLK_NRF
DIO_NRF: J8.2 R23.2 U8.23(SWDIO/NRESET) ; port DIO_NRF
NRF_UART_RX: U8.17(P0.11) ; port NRF_UART_RX
NRF_UART_TX: U8.15(P0.09) ; port NRF_UART_TX
NetC40_1: C40.1 U8.37(XC1) Y2.3(CRYSTAL_2)
NetC41_1: C41.1 U8.38(XC2) Y2.1(CRYSTAL_1)
NetC42_1: C42.1 U8.45(P0.26) Y3.2
NetC43_1: C43.1 U8.39(DEC1)
NetC44_1: C44.1 U8.46(P0.27) Y3.1
NetC47_1: C47.1 C48.2 L1.2
NetC47_2: C47.2 L2.2 U8.32(ANT2)
NetC49_2: C49.2 L1.1 RF1.1(SIG)
NetC50_2: C50.2 U8.29(DEC2)
NetC52_2: C52.2 C53.2 L3.1 U8.30(VDD_PA)
NetD6_2: D6.2(ANODE) R22.1
NetL2_1: L2.1 L3.2 U8.31(ANT1)
NetR22_2: R22.2 U8.7(P0.03)

Not connected (* = marked no-connect by the designer): U8 2(DCC) 3(P0.30) 4(P0.00) 5(P0.01) 6(P0.02) 8(P0.04) 9(P0.05) 10(P0.06) 11(P0.07) 14(P0.08) 16(P0.10) 18(P0.12) 19(P0.13) 20(P0.14) 21(P0.15) 22(P0.16) 25(P0.17) 26(P0.18) 27(P0.19) 28(P0.20) 40(P0.21) 41(P0.22) 42(P0.23) 43(P0.24) 44(P0.25) 47(P0.28) 48(P0.29)

### Library data of the parts
C40-C53 = CAP NP: PCB Footprint: C0402
D6 = LED: PCB Footprint: LED0603
L1-L3 = LQG15HS4N7C02D: Inductor; Manufacturer_Name: Murata Electronics; Datasheet Link: https://search.murata.co.jp/Ceramy/image/img/P02/JELF243B-0010.pdf; Height: 0.6mm; Manufacturer_Part_Number: LQG15HS4N7C02D; Mouser Part Number: 81-LQG15HS4N7C02D; Mouser Price/Stock: https://www.mouser.co.uk/ProductDetail/Murata-Electronics/LQG15HS4N7C02D?qs=60uY6ySkanQsgm4t8ngjFA%3D%3D; Arrow Part Number: LQG15HS4N7C02D; Arrow Price/Stock: https://www.arrow.com/en/products/lqg15hs4n7c02d/murata-manufacturing
R22-R24 = RESISTOR: PCB Footprint: R0402
RF1 = BWIPX-1-001E: Manufacturer: BAT WIRELESS(蝙蝠无线); Add into BOM: yes; Connector Type: 板端; Interface Type: 内针; Number of Ports: 1; Frequency-Max: 6GHz; RF Series: IPEX; Impedance: 50Ω; Symbol: BWIPX-1-001E; Device: BWIPX-1-001E; LCSC Part Name: IPEX 内针; Supplier Part: C496552; Manufacturer Part: BWIPX-1-001E; Supplier Footprint: SMD; JLCPCB Part Class: 扩展库; Datasheet: https://atta.szlcsc.com/upload/public/pdf/source/20201223/C496552_05E5A9956EAE1A8819C5051D085B1DED.pdf; Supplier: LCSC; Convert to PCB: yes; Interface Diameter: -; Interface Length/Height: -; Style: -; Operating Temperature Range: -
U8 = nRF51822-QFAA-R: Integrated Circuit; Manufacturer_Name: Nordic Semiconductor; Datasheet Link: https://datasheet.datasheetarchive.com/originals/distributors/Datasheets-DGA5/435665.pdf; Height: 0.95mm; Manufacturer_Part_Number: nRF51822-QFAA-R; Mouser Part Number: 949-NRF51822-QFAA-R; Mouser Price/Stock: https://www.mouser.co.uk/ProductDetail/Nordic-Semiconductor/nRF51822-QFAA-R?qs=7xCC5jQa1OJP%2FZdtChopZw%3D%3D; Arrow Part Number: NRF51822-QFAA-R; Arrow Price/Stock: https://www.arrow.com/en/products/nrf51822-qfaa-r/nordic-semiconductor?utm_currency=USD&region=nac
Y2 = Q22FA12800400: Crystal or Oscillator; Manufacturer_Name: Seiko Epson Corporation; Datasheet Link: https://datasheet.lcsc.com/szlcsc/Seiko-Epson-Q22FA12800400_C255875.pdf; Height: 0.5mm; Manufacturer_Part_Number: Q22FA12800400
Y3 = ABS05-32.768KHZ-9-T: Crystal or Oscillator; Manufacturer_Name: ABRACON; Datasheet Link: https://abracon.com/Resonators/ABS05.pdf; Height: 0.5mm; Manufacturer_Part_Number: ABS05-32.768KHZ-9-T; Mouser Part Number: 815-ABS05-32.768K9T; Mouser Price/Stock: https://www.mouser.co.uk/ProductDetail/ABRACON/ABS05-32.768KHZ-9-T?qs=Pyu0ZBy%2FIJbsNYnIET1z3A%3D%3D; Arrow Part Number: ABS05-32.768KHZ-9-T; Arrow Price/Stock: https://www.arrow.com/en/products/abs05-32.768khz-9-t/abracon?region=nac
J8 = 4 HEADER: PCB Footprint: ISP-4P-2_54

## Sheet BMI160.SchDoc
size A4
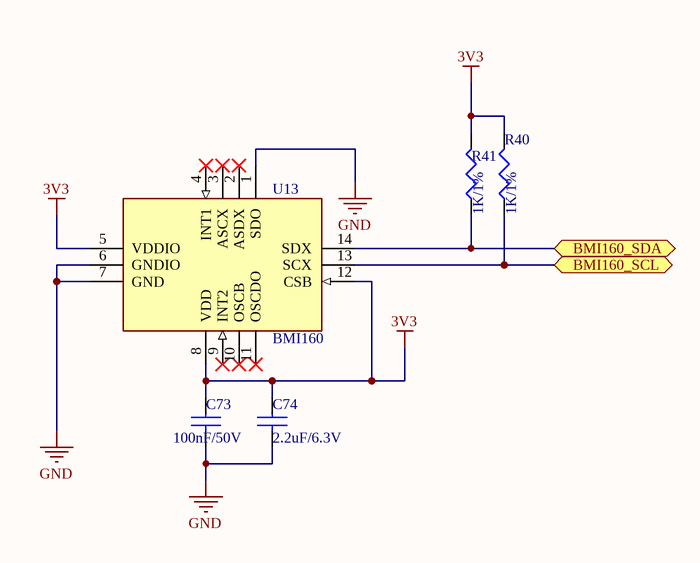
[diagram p6: BMI160.SchDoc]

### Parts
C73  100nF/50V  [C0402]
C74  2.2uF/6.3V  [C0402]
R40  1K/1%  [R0402]
R41  1K/1%  [R0402]
U13  BMI160  [PQFN50P300X250X88-14N]

### Ports
BMI160_SCL (bidir, see VESC_75100[2C]), BMI160_SDA (bidir, see VESC_75100[2C])

### Nets
3V3: C73.1 C74.1 R40.2 R41.2 U13.5(VDDIO) U13.8(VDD) U13.12(CSB)
GND: C73.2 C74.2 U13.1(SDO) U13.6(GNDIO) U13.7(GND)
BMI160_SCL: R40.1 U13.13(SCX) ; port BMI160_SCL
BMI160_SDA: R41.1 U13.14(SDX) ; port BMI160_SDA

Not connected (* = marked no-connect by the designer): U13 2(ASDX)* 3(ASCX)* 4(INT1)* 9(INT2)* 10(OSCB)* 11(OSCDO)*

### Library data of the parts
C73 C74 = CAP NP: PCB Footprint: C0402
R40 R41 = RESISTOR: PCB Footprint: R0402
U13 = BMI160: Integrated Circuit; Manufacturer_Name: BOSCH; Datasheet Link: https://datasheet.datasheetarchive.com/originals/distributors/DKDS41/DSANUWW0031095.pdf; Height: 0.88mm; Manufacturer_Part_Number: BMI160; Mouser Part Number: 262-BMI160; Mouser Price/Stock: https://www.mouser.co.uk/ProductDetail/Bosch-Sensortec/BMI160?qs=Lj1LZLjqIN1DEsUDgjehlg%3D%3D; Arrow Part Number: BMI160; Arrow Price/Stock: https://www.arrow.com/en/products/bmi160/bosch?region=nac

## Sheet Connector.SchDoc
size A4
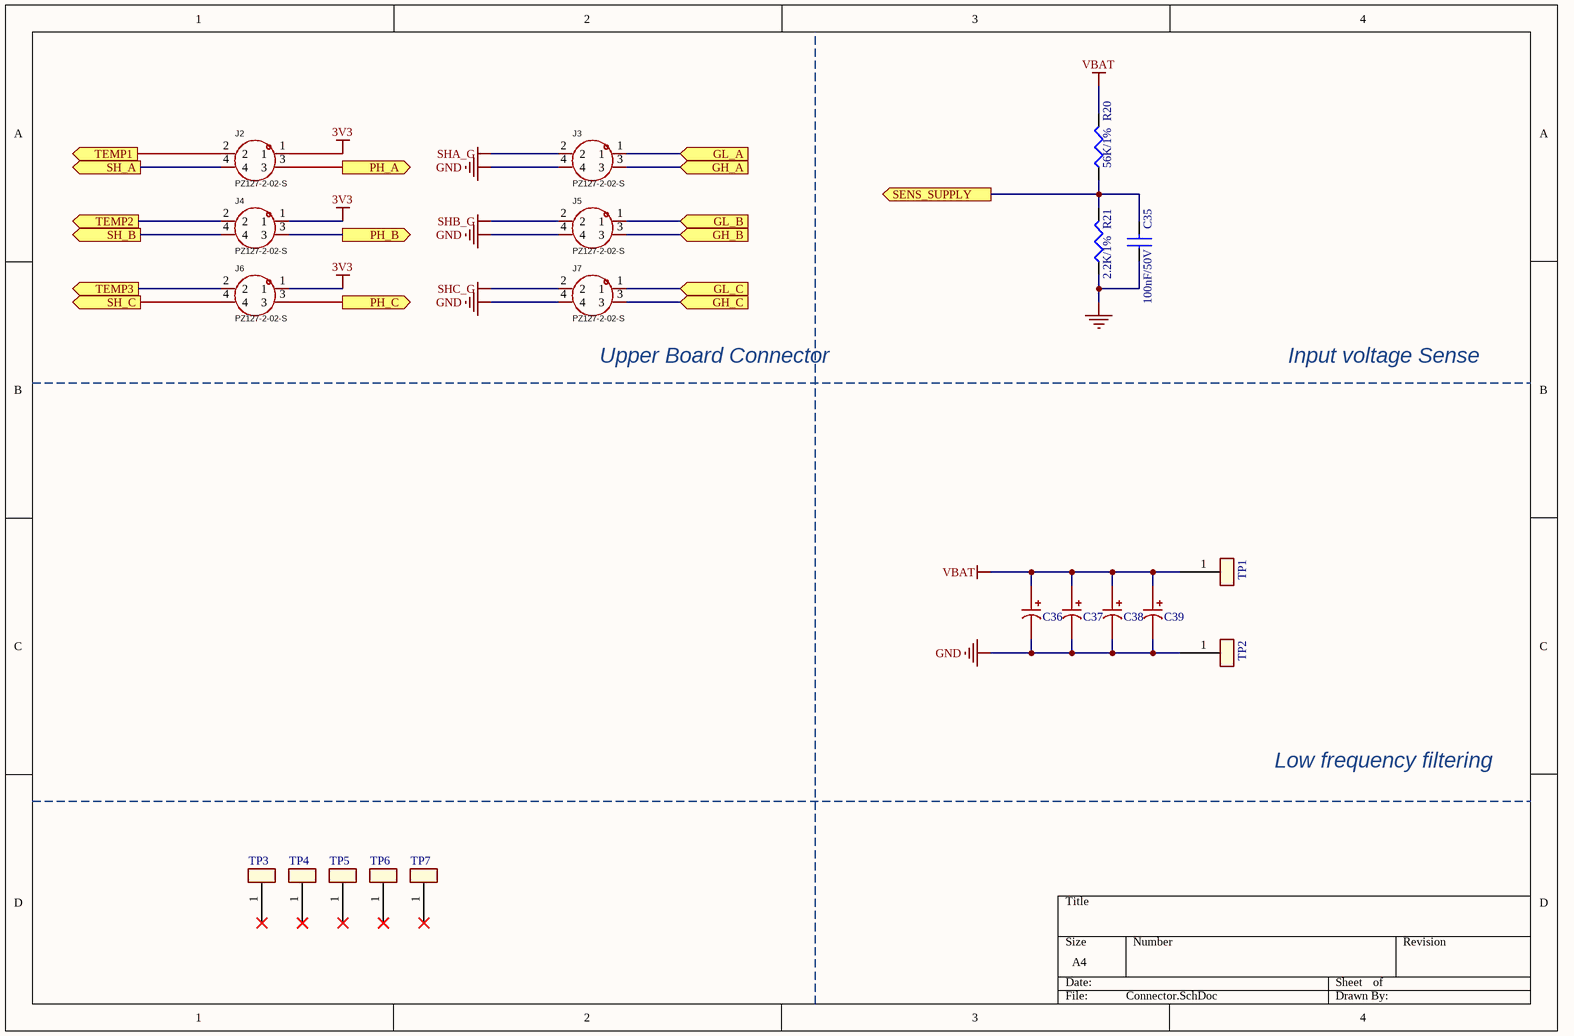
[diagram p7: Connector.SchDoc]

### Parts
C35  100nF/50V  [C0402]
C36  680uF  [CAP-TH_10.0x17mm]  (value not drawn)
C37  680uF  [CAP-TH_10.0x17mm]  (value not drawn)
C38  680uF  [CAP-TH_10.0x17mm]  (value not drawn)
C39  680uF  [CAP-TH_10.0x17mm]  (value not drawn)
J2  PZ127-2-02-S  [HDR-SMD_4P-P1.27-V-M-R2-C2-LS5.3]
J3  PZ127-2-02-S  [HDR-SMD_4P-P1.27-V-M-R2-C2-LS5.3]
J4  PZ127-2-02-S  [HDR-SMD_4P-P1.27-V-M-R2-C2-LS5.3]
J5  PZ127-2-02-S  [HDR-SMD_4P-P1.27-V-M-R2-C2-LS5.3]
J6  PZ127-2-02-S  [HDR-SMD_4P-P1.27-V-M-R2-C2-LS5.3]
J7  PZ127-2-02-S  [HDR-SMD_4P-P1.27-V-M-R2-C2-LS5.3]
R20  56K/1%  [R0402]
R21  2.2K/1%  [R0402]
TP1  TEST POINT  [HOLE-4MM_M]  (value not drawn)
TP2  TEST POINT  [HOLE-4MM_M]  (value not drawn)
TP3  TEST POINT  [HOLE-6.2MM_M]  (value not drawn)
TP4  TEST POINT  [HOLE-6.2MM_M]  (value not drawn)
TP5  TEST POINT  [HOLE-6.2MM_M]  (value not drawn)
TP6  TEST POINT  [HOLE-6.2MM_M]  (value not drawn)
TP7  TEST POINT  [HOLE-6.2MM_M]  (value not drawn)

### Ports
GH_A (in, see VESC_75100[3A]), GH_B (in, see VESC_75100[3B]), GH_C (in, see VESC_75100[3B]), GL_A (in, see VESC_75100[3B]), GL_B (in, see VESC_75100[3B]), GL_C (in, see VESC_75100[3B]), PH_A (out, see VESC_75100[3B]), PH_B (out, see VESC_75100[3B]), PH_C (out, see VESC_75100[3B]), SENS_SUPPLY (out, see VESC_75100[4B]), SH_A (out, see VESC_75100[3B]), SH_B (out, see VESC_75100[3B]), SH_C (out, see VESC_75100[3B]), TEMP1 (out, see VESC_75100[4B]), TEMP2 (out, see VESC_75100[4B]), TEMP3 (out, see VESC_75100[4B])

### Nets
3V3: J2.1 J4.1 J6.1
GND: C35.1 C36.2 C37.2 C38.2 C39.2 J3.4 J5.4 J7.4 R21.1 TP2.1
SHA_G: J3.2
SHB_G: J5.2
SHC_G: J7.2
VBAT: C36.1 C37.1 C38.1 C39.1 R20.2 TP1.1
ADC_TEMP1: J2.2 ; port TEMP1
ADC_TEMP2: J4.2 ; port TEMP2
ADC_TEMP3: J6.2 ; port TEMP3
ADC_VIN: C35.2 R20.1 R21.2 ; port SENS_SUPPLY
GH_A: J3.3 ; port GH_A
GH_B: J5.3 ; port GH_B
GH_C: J7.3 ; port GH_C
GL_A: J3.1 ; port GL_A
GL_B: J5.1 ; port GL_B
GL_C: J7.1 ; port GL_C
PHA: J2.3 ; port PH_A
PHB: J4.3 ; port PH_B
PHC: J6.3 ; port PH_C
SHA: J2.4 ; port SH_A
SHB: J4.4 ; port SH_B
SHC: J6.4 ; port SH_C

Not connected (* = marked no-connect by the designer): TP3 1*; TP4 1*; TP5 1*; TP6 1*; TP7 1*

### Notes on the sheet
- (near J7) Upper Board Connector
- Input voltage Sense
- Low frequency filtering

### Library data of the parts
C35 = CAP NP: PCB Footprint: C0402
C36-C39 = ERS1VM681G16OT: 容值:680uF;精度:±20%;额定电压:35V;纹波电流:-;等效串联电阻:-;; Manufacturer: AISHI(艾华集团); Add into BOM: yes; Tolerance: ±20%; Rated Voltage: 35V; Symbol: ERS1VM681G16OT; Device: ERS1VM681G16OT; LCSC Part Name: 680uF ±20% 35V; Supplier Part: C721283; Manufacturer Part: ERS1VM681G16OT; Supplier Footprint: 插件,D10xL16mm; Datasheet: https://atta.szlcsc.com/upload/public/pdf/source/20191015/C438940_4B8E60A742BB0AE40DDEF87A5C89089D.pdf; Supplier: LCSC; Convert to PCB: yes; Value: 680uF; Ripple Current: -; Equivalent Series Resistance(ESR): -; Lead Spacing: -; φD: -; L: -; Lifetime @ Temp: -
J2-J7 = PZ127-2-02-S: Manufacturer: HCTL(华灿天禄); Add into BOM: yes; Pin Structure: 2x2P; Pitch: 1.27mm; Circluar Pins/Square Pins: 方针; Current Rating (Max): 1A; Soldering Temperature(Max): 260℃@10S; Symbol: PZ127-2-02-S; Device: PZ127-2-02-S; LCSC Part Name: 2x2P 间距:1.27mm 方针 立贴; Supplier Part: C3975185; Manufacturer Part: PZ127-2-02-S; Supplier Footprint: SMD,P=1.27mm; JLCPCB Part Class: Extended Part; Datasheet: https://atta.szlcsc.com/upload/public/pdf/source/20230609/2ACB07ADC7D4DAF6D292F3D23C037F6C.pdf; Supplier: LCSC; Convert to PCB: yes; Row Spacing: 1.27mm; Mounting Type: 立贴; Number of Rows: 双排; Number of Pins: 4P; Length of Mating Pin: 4mm; Insulation Height: 1.5mm; Length of End Connection Pin: -; Contact Material: 黄铜; Operating Temperature Range: -40℃~+105℃; Color: 黑色
R20 R21 = RESISTOR: PCB Footprint: R0402

## Sheet Buzzer.SchDoc
size A4
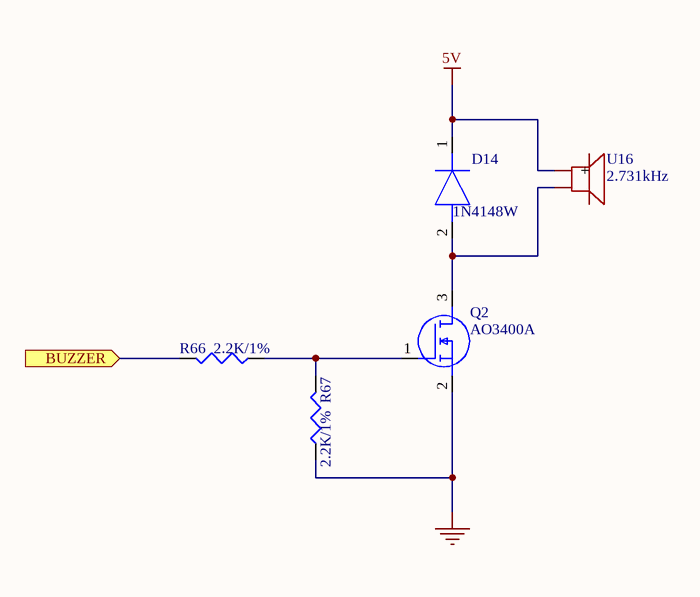
[diagram p8: Buzzer.SchDoc]

### Parts
D14  1N4148W  [1N4148WVGS08]
Q2  AO3400A  [SOT95P280X125-3N]
R66  2.2K/1%  [R0402]
R67  2.2K/1%  [R0402]
U16  2.731kHz  [BUZ-SMD_4P-L7.5-W7.5-BR]

### Ports
BUZZER (in, see VESC_75100[3C])

### Nets
5V: D14.1(K) U16.1(+)
GND: Q2.2(S) R67.1
BUZZER: R66.2 ; port BUZZER
NetD14_2: D14.2(A) Q2.3(D) U16.2
NetQ2_1: Q2.1(G) R66.1 R67.2

Not connected (* = marked no-connect by the designer): U16 3 4

### Library data of the parts
D14 = 1N4148W-V-GS08: Diode; Manufacturer_Name: Vishay; Datasheet Link: https://us.rs-online.com/m/d/a2789c8794cb0c42ced29f2dd8571f3c.pdf; Height: 1.35mm; Manufacturer_Part_Number: 1N4148W-V-GS08; Mouser Part Number: 625-1N4148W-V; Mouser Price/Stock: https://www.mouser.co.uk/ProductDetail/Vishay-Semiconductors/1N4148W-V-GS08?qs=TNTIDjy6APrS%2Fdgq1RSs3A%3D%3D; Arrow Part Number: 1N4148W-V-GS08; Arrow Price/Stock: https://www.arrow.com/en/products/1n4148w-v-gs08/vishay
Q2 = AO3400A: as Q1 on sheet Interface; Datasheet Link: http://aosmd.com/res/data_sheets/AO3400A.pdf; Height: 1.25mm; Manufacturer_Part_Number: AO3400A; Arrow Part Number: AO3400A; Arrow Price/Stock: https://www.arrow.com/en/products/ao3400a/alpha-and-omega-semiconductor?utm_currency=USD&region=nac
R66 R67 = RESISTOR: PCB Footprint: R0402
U16 = HYG-7525A: Manufacturer: HYDZ(华宇); Add into BOM: yes; Current Consumption: 90mA; Sound Pressure Level(SPL): 85dB; Symbol: HYG-7525A; Device: HYG-7525A; LCSC Part Name: 贴片无源蜂鸣器; Supplier Part: C7544812; Manufacturer Part: HYG-7525A; Supplier Footprint: SMD,7.5x7.5mm; JLCPCB Part Class: 扩展库; Datasheet: https://atta.szlcsc.com/upload/public/pdf/source/20230825/78098EC44B170663F3151CF5366FAD5D.pdf; Supplier: LCSC; Convert to PCB: yes; Value: 2.731kHz

## Nets that join several sheets
3V3: MCU (16 pins), Gate_Drive (12 pins), Interface (8 pins), Power (C72.1 L8.2 TP11.1), BMI160 (7 pins), Connector (J2.1 J4.1 J6.1)
3V3_RF: Power (C62.1 L5.2 TP9.1), NRF51822 (9 pins)
5V: Interface (6 pins), Power (5 pins), Buzzer (D14.1 U16.1)
12V: Gate_Drive (12 pins), Interface (D11.1 J9.2), Power (7 pins)
GND: MCU (23 pins), Gate_Drive (30 pins), Interface (33 pins), Power (28 pins), NRF51822 (24 pins), BMI160 (5 pins), Connector (10 pins), Buzzer (Q2.2 R67.1)
SHA_G: Gate_Drive (C25.1 R7.2 U4.6), Connector (J3.2)
SHB_G: Gate_Drive (C21.1 R11.2 U3.6), Connector (J5.2)
SHC_G: Gate_Drive (C16.1 R14.2 U2.6), Connector (J7.2)
VBAT: Interface (R48.1), Power (C55.1 C56.1 U9.1 U9.9), Connector (6 pins)
ADC_TEMP1: MCU (U1.17), Connector (J2.2)
ADC_TEMP2: MCU (U1.26), Connector (J4.2)
ADC_TEMP3: MCU (U1.27), Connector (J6.2)
ADC_VIN: MCU (U1.11), Connector (C35.2 R20.1 R21.2)
AUX: MCU (U1.2), Interface (Q1.1 R59.1)
BMI160_SCL: MCU (U1.50), BMI160 (R40.1 U13.13)
BMI160_SDA: MCU (U1.28), BMI160 (R41.1 U13.14)
BRAKE: MCU (U1.22), Interface (C80.2 R52.2)
BUCK_EN: MCU (U1.33), Power (R25.1 R26.2)
BUZZER: MCU (U1.59), Buzzer (R66.2)
CAN_RX: MCU (U1.61), Interface (U15.4)
CAN_TX: MCU (U1.62), Interface (U15.1)
CLK_NRF: MCU (U1.55), NRF51822 (J8.3 R24.2 U8.24)
CURRENT_1: MCU (U1.8), Gate_Drive (C26.2 R17.1)
CURRENT_2: MCU (U1.9), Gate_Drive (C29.2 R18.1)
CURRENT_3: MCU (U1.10), Gate_Drive (C32.2 R19.1)
DIO_NRF: MCU (U1.56), NRF51822 (J8.2 R23.2 U8.23)
GH_A: Gate_Drive (R13.1), Connector (J3.3)
GH_B: Gate_Drive (R9.1), Connector (J5.3)
GH_C: Gate_Drive (R5.1), Connector (J7.3)
GL_A: Gate_Drive (R16.1), Connector (J3.1)
GL_B: Gate_Drive (R10.1), Connector (J5.1)
GL_C: Gate_Drive (R6.1), Connector (J7.1)
HALL_1: MCU (U1.37), Interface (R50.2)
HALL_2: MCU (U1.38), Interface (R51.2)
HALL_3: MCU (U1.39), Interface (R53.2)
HIN1: MCU (U1.41), Gate_Drive (U4.2)
HIN2: MCU (U1.42), Gate_Drive (U3.2)
HIN3: MCU (U1.43), Gate_Drive (U2.2)
LIN1: MCU (U1.34), Gate_Drive (U4.3)
LIN2: MCU (U1.35), Gate_Drive (U3.3)
LIN3: MCU (U1.36), Gate_Drive (U2.3)
M_TEMP: MCU (U1.24), Interface (C75.1 D12.3 J10.6 R44.1)
NRF_UART_RX: MCU (U1.51), NRF51822 (U8.17)
NRF_UART_TX: MCU (U1.52), NRF51822 (U8.15)
PHA: Gate_Drive (U5.3), Connector (J2.3)
PHB: Gate_Drive (U6.3), Connector (J4.3)
PHC: Gate_Drive (U7.3), Connector (J6.3)
POWER_EN: Interface (J10.11), Power (R30.2)
RX_SDA_NSS: MCU (U1.20 U1.30), Interface (J9.5)
SCK_ADC_EXT: MCU (U1.21), Interface (C81.2 R54.2)
SERVO: MCU (U1.58), Interface (C76.2 R49.1)
SHA: Gate_Drive (U5.2), Connector (J2.4)
SHB: Gate_Drive (U6.2), Connector (J4.4)
SHC: Gate_Drive (U7.2), Connector (J6.4)
SWITCH_SENSE: MCU (U1.25), Power (C63.1 R33.2)
TX_SCL_MOSI: MCU (U1.23 U1.29), Interface (J9.6)
USB_DM: MCU (U1.44), Interface (R61.1)
USB_DP: MCU (U1.45), Interface (R60.1)
VOLTAGE_A: MCU (U1.14), Gate_Drive (C17.2 R7.1 R8.2)
VOLTAGE_B: MCU (U1.15), Gate_Drive (C20.2 R11.1 R12.2)
VOLTAGE_C: MCU (U1.16), Gate_Drive (C24.2 R14.1 R15.2)